# EAGLE design Retrolite_CM4_-_Left_PCB (EAGLE 9.6.2)
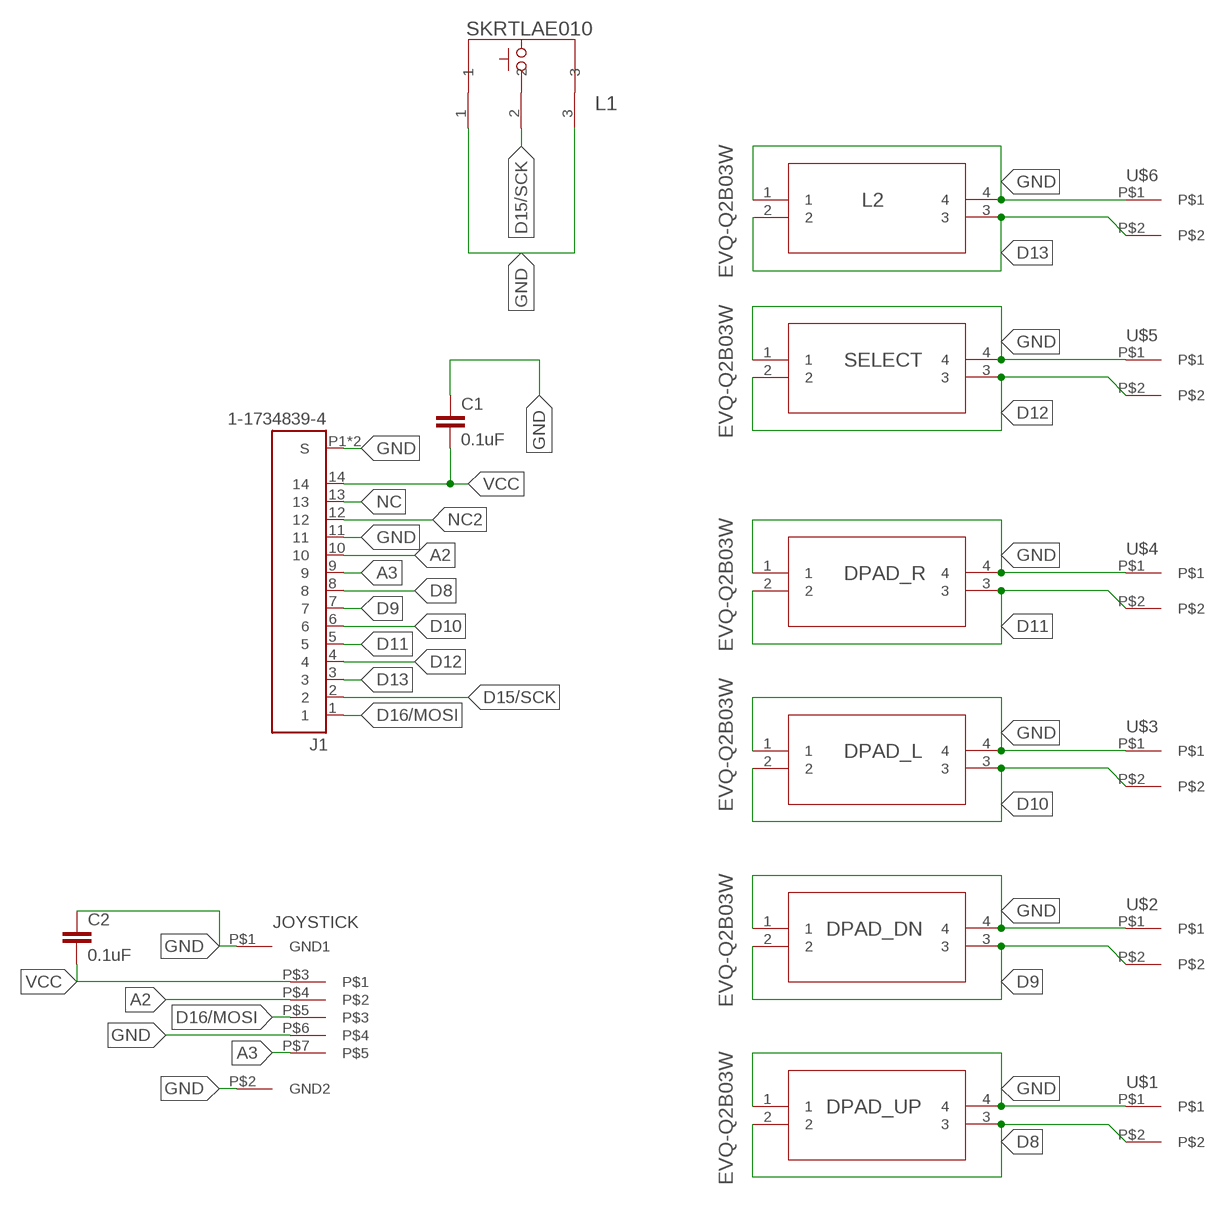
[diagram p0: schematic, sheet 1]

## Parts
C1  0.1uF  0.1UF-0603-25V-5%  [0603]
C2  0.1uF  0.1UF-0603-25V-5%  [0603]
DPAD_DN  EVQ-Q2B03W  [EVQQ2_3]
DPAD_L  EVQ-Q2B03W  [EVQQ2_3]
DPAD_R  EVQ-Q2B03W  [EVQQ2_3]
DPAD_UP  EVQ-Q2B03W  [EVQQ2_3]
J1  1-1734839-4  [TE_1-1734839-4]
JOYSTICK  0545500571  [0545500571]
L1  SKRTLAE010  [SW3_SKRTLAE010_ALPS]
L2  EVQ-Q2B03W  [EVQQ2_3]
SELECT  EVQ-Q2B03W  [EVQQ2_3]
U$1  MEMBRANEBUTTON  [MEMBRANEBUTTON]
U$2  MEMBRANEBUTTON  [MEMBRANEBUTTON]
U$3  MEMBRANEBUTTON  [MEMBRANEBUTTON]
U$4  MEMBRANEBUTTON  [MEMBRANEBUTTON]
U$5  MEMBRANEBUTTON  [MEMBRANEBUTTON]
U$6  MEMBRANEBUTTON  [MEMBRANEBUTTON]

## Nets
A2: J1.10 JOYSTICK.P$4
A3: J1.9 JOYSTICK.P$7
D8: DPAD_UP.2 DPAD_UP.3 J1.8 U$1.P$2
D9: DPAD_DN.2 DPAD_DN.3 J1.7 U$2.P$2
D10: DPAD_L.2 DPAD_L.3 J1.6 U$3.P$2
D11: DPAD_R.2 DPAD_R.3 J1.5 U$4.P$2
D12: J1.4 SELECT.2 SELECT.3 U$5.P$2
D13: J1.3 L2.2 L2.3 U$6.P$2
D15/SCK: J1.2 L1.2
D16/MOSI: J1.1 JOYSTICK.P$5
GND: C1.1 C2.1 DPAD_DN.1 DPAD_DN.4 DPAD_L.1 DPAD_L.4 DPAD_R.1 DPAD_R.4 DPAD_UP.1 DPAD_UP.4 J1.11 J1.P1(S) J1.P2(S) JOYSTICK.P$1(GND1) JOYSTICK.P$2(GND2) JOYSTICK.P$6 L1.1 L1.3 L2.1 L2.4 SELECT.1 SELECT.4 U$1.P$1 U$2.P$1 U$3.P$1 U$4.P$1 U$5.P$1 U$6.P$1
NC: J1.13
NC2: J1.12
VCC: C1.2 C2.2 J1.14 JOYSTICK.P$3

## Library data of the parts
C1 C2 = SparkFun-Capacitors:0.1UF: 0.1µF ceramic capacitors A capacitor is a passive two-terminal electrical component used to store electrical energy temporarily in an electric field.; PROD_ID: CAP-08604
DPAD_DN DPAD_L DPAD_R DPAD_UP L2 SELECT = EVQ-Q2B03W:EVQ-Q2B03W; AVAILABILITY: Unavailable; DESCRIPTION: Tactile Switch SPST-NO Top Actuated Surface Mount; MF: Panasonic Electronic; MP: EVQQ2B03W; PACKAGE: None; PRICE: None
J1 = 1-1734839-4:1-1734839-4: Conn FPC Connector SKT 14 POS 0.5mm Solder RA SMD T/R; COMMENT: 1-1734839-4; DESCRIPTION: Conn FPC Connector SKT 14 POS 0.5mm Solder RA SMD T/R; DIGI-KEY_PART_NUMBER: A100295CT-ND; EU_ROHS_COMPLIANCE: Compliant; MF: TE Connectivity; MP: 1-1734839-4; PACKAGE: None; PURCHASE-URL: https://pricing.snapeda.com/search/part/1-1734839-4/?ref=eda
JOYSTICK = Molex FFC:0545500571
L1 = SKRTLAE010:SKRTLAE010; BUILT_BY: EMA_Justin; COPYRIGHT: Copyright (C) 2016 Accelerated Designs. All rights reserved; MANUFACTURER_PART_NUMBER: SKRTLAE010; SOURCELIBRARY: ALPS_2018-12-15; VENDOR: ALPS
U$1-U$6 = Membrane Button:MEMBRANEBUTTON

## Board
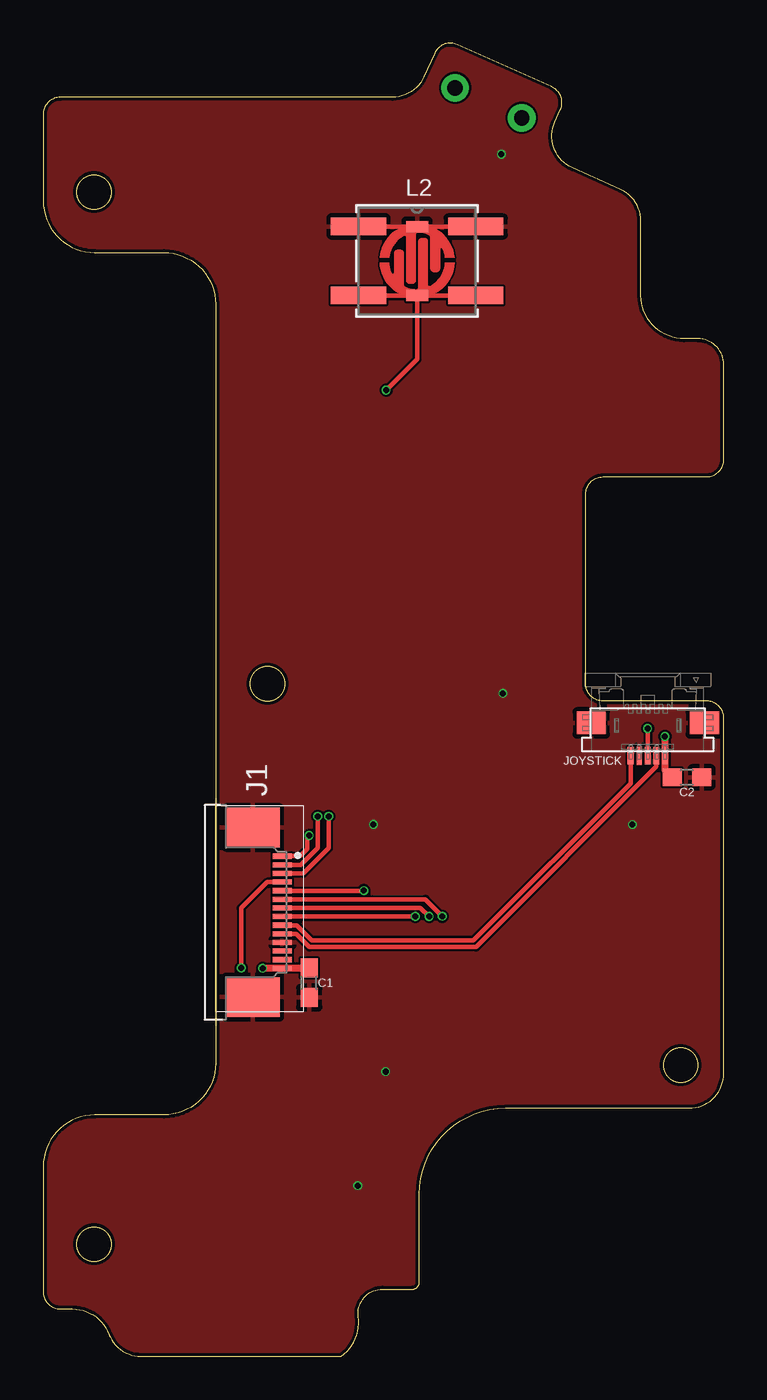
[diagram p1: board, top side]
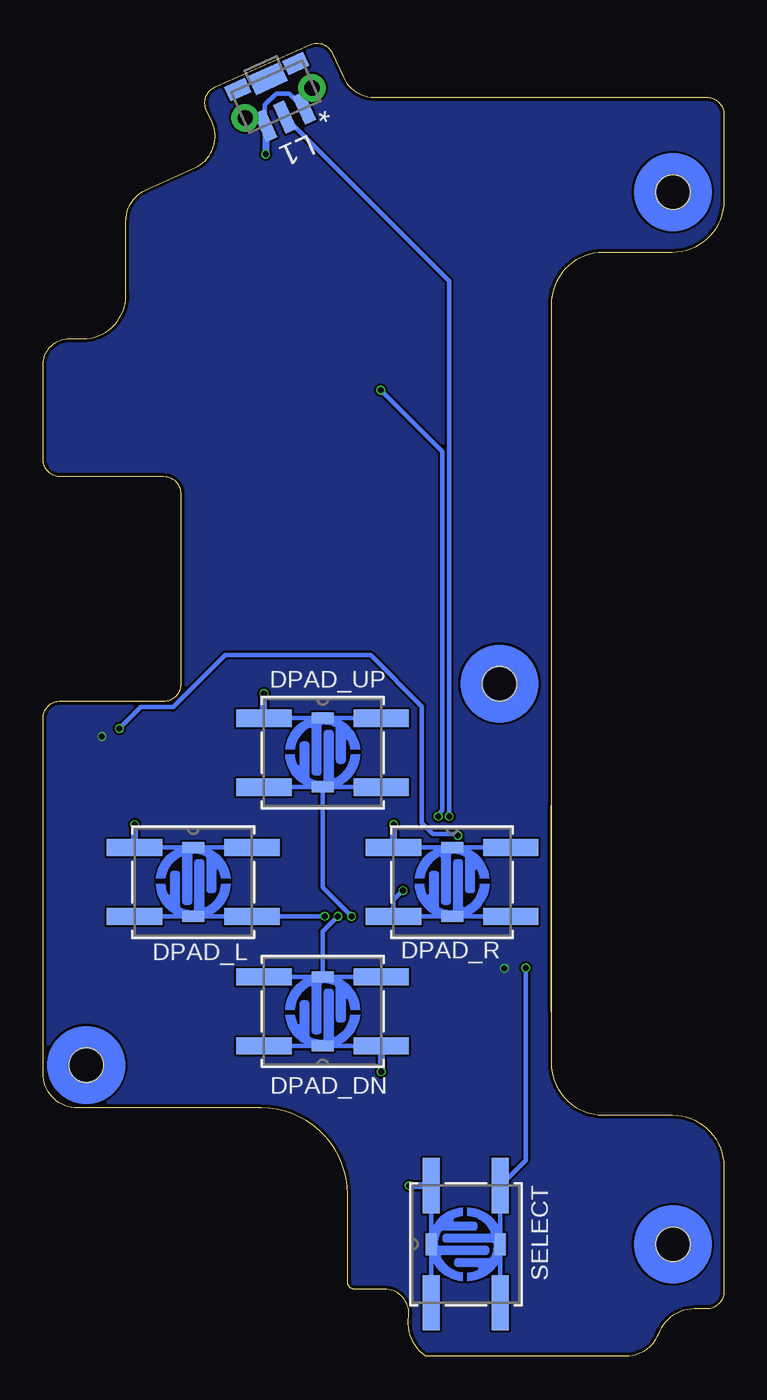
[diagram p2: board, bottom side, seen from below]

Size 39.45 x 76.14 mm. Coordinates in mm from the lower left corner, seen from the top.
Outline: 10,20 10,31.93
Outline: 0,11 0,3.75 arc90 1,2.75 1.7,2.75 arc-69 3.81,1.29 arc69 5.68,0 17.29,0 arc60 18.27,2.31 18.27,2.32 arc-97 19.66,3.89 21.4,3.89 arc90 21.8,4.29 21.8,9.39 arc-90 26.8,14.39 37.45,14.39 arc90 39.45,16.39 39.45,36.99 arc90 38.45,37.99 32.45,37.99 arc-90 31.45,38.99 31.45,49.99 arc-90 32.45,50.99 38.45,50.99 arc90 39.45,51.99 39.45,57.5 arc90 37.95,59 37.15,59 arc-90 34.65,61.5 34.65,65.83 arc66 33.47,67.66 30.67,68.91 arc-90 29.66,71.55 29.98,72.28 arc90 29.48,73.6 24,76.05 arc90 22.68,75.55 22.07,74.18 arc-66 20.25,73 1,73 arc90 0,72 0,67 arc90 3,64 7,64 arc-90 10,61 10,17 arc-90 7,14 3,14 arc90 0,11
Outline: circle at 2.95,6.5 radius 1
Outline: circle at 2.95,67.5 radius 1
Outline: circle at 13,39 radius 1
Outline: circle at 36.95,16.9 radius 1
Copper layers (1*16): Top 0.035mm / dielectric 1.6mm / Bottom 0.035mm
Design rules "jlcpcb-2layers *": minimum track width 5mil, minimum drill 0.3mm, track to track 5mil, track to pad 5mil, pad to pad 5mil, via to via 5mil, smd to smd 5mil, copper to edge 0.2mm, drill to drill 6mil, minimum pad ring 10mil, minimum via ring 3mil, stop-mask expansion 0mil, vias tented up to drill 30mil, thermal gap 10mil

### Footprints (pad centres in the part's own frame; a part is rotated, then mirrored left to right if it is on the bottom)
0603 = smd 1.1 x 1: 1 -0.85,0; 2 0.85,0
EVQQ2_3 = smd 3.2 x 0.991: 1 -3.4,2; 2 -3.4,-2; 3 3.4,-2; 4 3.4,2
TE_1-1734839-4 = smd 0.3 x 1.1: 1 -3.25,0; 2 -2.75,0; 3 -2.25,0; 4 -1.75,0; 5 -1.25,0; 6 -0.75,0; 7 -0.25,0; 8 0.25,0; 9 0.75,0; 10 1.25,0; 11 1.75,0; 12 2.25,0; 13 2.75,0; 14 3.25,0 | smd 2.3 x 3.1: P1 -4.92,-1.7; P2 4.92,-1.7
0545500571 = smd 1.65 x 1.3: P$1 -2.275,-0.65; P$2 4.275,-0.65 | smd 0.3 x 1: P$3 0,1.25; P$4 0.5,1.25; P$5 1,1.25; P$6 1.5,1.25; P$7 2,1.25
SW3_SKRTLAE010_ALPS = smd 0.686 x 1.8: 1 0,0; 2 1.23,0; 3 2.46,0 | drill 0.889 pad 0.889: 4 -0.889,-0.889; 5 3.353,-0.889 | smd 1.3 x 0.9: 6 -0.62,-2.565; 8 3.08,-2.565 | smd 2.007 x 1.194: 7 1.23,-2.438
MEMBRANEBUTTON = smd 0.635 x 1.27: P$1 2,0; P$2 -2,0

### Placement (x,y rotation side)
C1  15.42,21.66 90 top
C2  37.31,33.57 180 top
DPAD_DN  23.25,20 180 bottom
DPAD_L  30.75,27.5 0 bottom
DPAD_R  15.75,27.5 0 bottom
DPAD_UP  23.25,35 0 bottom
J1  13.86,25.75 270 top
JOYSTICK  36.04,36.08 180 top
L1  24.32,72.37 204.2 bottom
L2  21.67,63.51 0 top
SELECT  14.95,6.5 90 bottom
U$1  23.25,35 90 bottom
U$2  23.25,20 270 bottom
U$3  30.75,27.5 90 bottom
U$4  15.75,27.5 90 bottom
U$5  14.95,6.5 180 bottom
U$6  21.67,63.51 90 top

### Tracks (layer width: path | path; a pad name or v marks a point on that pad's centre or on a via)
A2
  Top 0.254: JOYSTICK.P$4 35.55,34.19 25.09,23.73 15.43,23.73 14.66,24.5 J1.10
A3
  Top 0.254: J1.9 14.7,25 15.58,24.12 24.94,24.12 34.04,33.22 JOYSTICK.P$7
D8  (via drill 0.35)
  Top 0.254: J1.8 v21.57,25.5
  Bottom 0.254: v21.57,25.5 23.25,27.19 23.25,32.85 | 23.25,32.85 U$1.P$2 DPAD_UP.2 | DPAD_UP.3 23.1,33 23.25,32.85
D9  (via drill 0.35)
  Top 0.254: J1.7 20.94,26 20.95,26.01 21.87,26.01 v22.37,25.51 v22.37,25.5
  Bottom 0.254: v22.37,25.5 23.25,24.62 U$2.P$2 | DPAD_DN.3 U$2.P$2 | DPAD_DN.2 U$2.P$2
D10  (via drill 0.35)
  Top 0.254: J1.6 22.15,26.5 v23.13,25.52
  Bottom 0.254: DPAD_L.2 U$3.P$2 DPAD_L.3 27.33,25.52 v23.13,25.52
D11  (via drill 0.35)
  Top 0.254: J1.5 v18.59,27 v18.59,27.01
  Bottom 0.254: DPAD_R.3 U$4.P$2 DPAD_R.2 19.15,26.45 v18.59,27.01
D12  (via drill 0.35)
  Top 0.254: J1.4 12.99,27.5 11.48,25.99 v11.48,22.52
  Bottom 0.254: v11.48,22.52 11.48,11.37 SELECT.3 U$5.P$2 SELECT.2
D13  (via drill 0.35)
  Top 0.254: J1.3 15.07,28 16.55,29.47 v16.55,31.31 | v19.88,56.02 21.67,57.81 U$6.P$2 | L2.2 U$6.P$2 | U$6.P$2 L2.3
  Bottom 0.254: v16.55,31.31 16.55,31.41 16.31,31.65 16.31,52.45 v19.88,56.02
D15/SCK  (via drill 0.35)
  Top 0.254: J1.2 14.93,28.5 15.92,29.48 v15.92,31.31
  Bottom 0.254: v15.92,31.31 15.92,62.34 L1.2
D16/MOSI  (via drill 0.35)
  Top 0.254: v35.03,36.4 35.03,34.84 JOYSTICK.P$5 | J1.1 14.9,29 15.31,29.41 15.31,30.09 v15.41,30.2
  Bottom 0.254: v35.03,36.4 33.79,37.64 31.92,37.64 28.9,40.66 20.47,40.66 17.5,37.69 17.5,30.92 16.87,30.29 15.5,30.29 v15.41,30.2
GND  (via drill 0.35)
  Top 0.254: L2.1 U$6.P$1 L2.4
  Bottom 0.254: DPAD_UP.4 U$1.P$1 DPAD_UP.1 | DPAD_DN.4 U$2.P$1 DPAD_DN.1 | DPAD_L.1 U$3.P$1 DPAD_L.4 | SELECT.4 U$5.P$1 SELECT.1 | L1.1 24.35,72.36 25.18,73.2 25.95,73.2 26.6,72.56 26.6,71.39 L1.3 | DPAD_R.4 U$4.P$1 DPAD_R.1
  Bottom 0.406: DPAD_L.1 v34.15,30.83 | DPAD_DN.1 v19.85,16.51 | SELECT.4 v18.23,9.9 | DPAD_UP.1 v26.65,38.44 | DPAD_R.1 v19.14,30.84 | L1.3 v26.56,69.7
  pour Top: -3.98,74 -3.98,67 4.02,59 4.02,22 -3.98,14 -3.98,2 4.02,-6 17.02,-6 27.02,4 27.02,10 43.02,10 45.02,12 45.02,63 31.02,77 -0.98,77
VCC  (via drill 0.35)
  Top 0.406: C1.2 13.87,22.51 J1.14 v12.72,22.5 | C2.2 36.04,33.99 JOYSTICK.P$3 v36.04,35.94
  pour Bottom: -0.98,77 -0.98,61 7.02,53 7.02,21 -1.98,12 -1.98,2 7.02,-7 17.02,-7 31.02,7 36.02,12 42.02,12 42.02,65 41.02,66 27.02,80 23.02,80 2.02,80
(copper drawn outside any net)
  shapes: Bottom circle x4